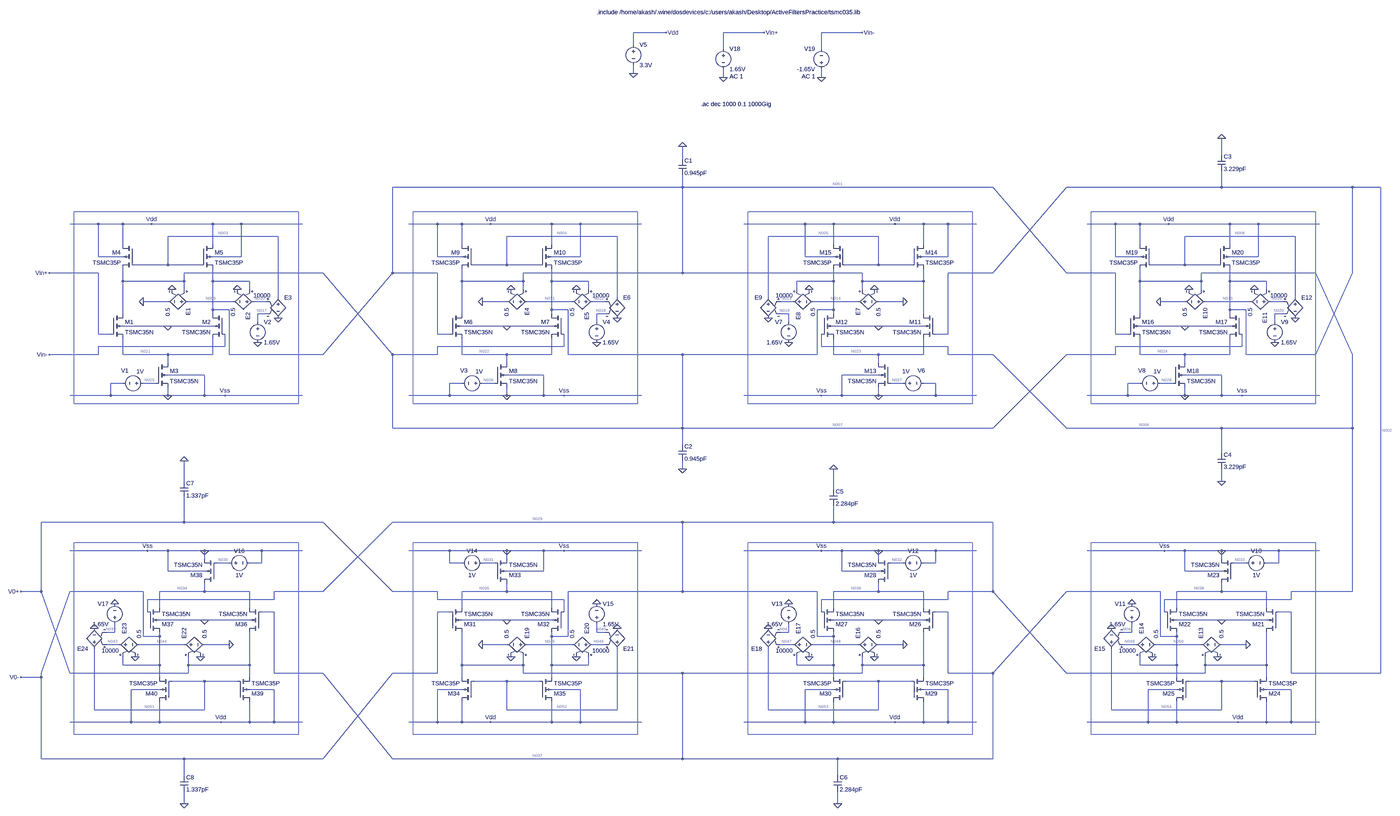
[diagram p0: schematic AFProject_Transistor_Level_Realization_2.asc, whole sheet]
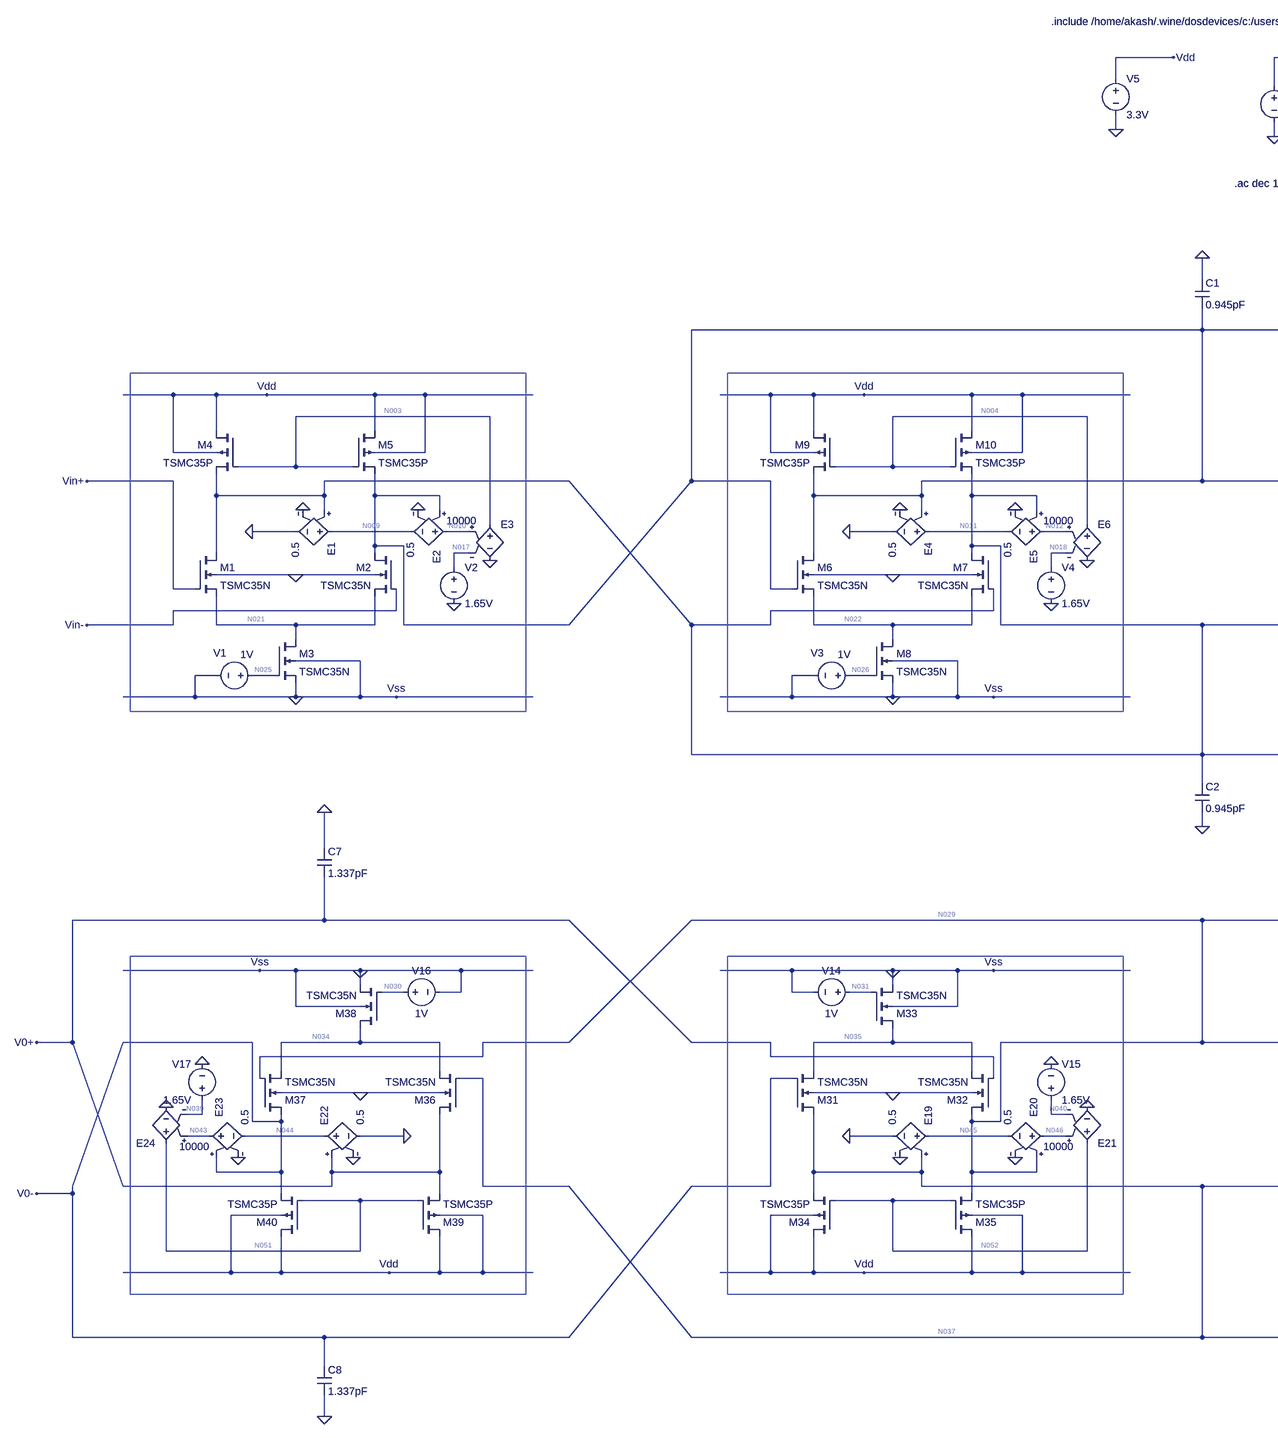
[diagram p1: schematic AFProject_Transistor_Level_Realization_2.asc, part, row 1 of 1, column 1 of 2]
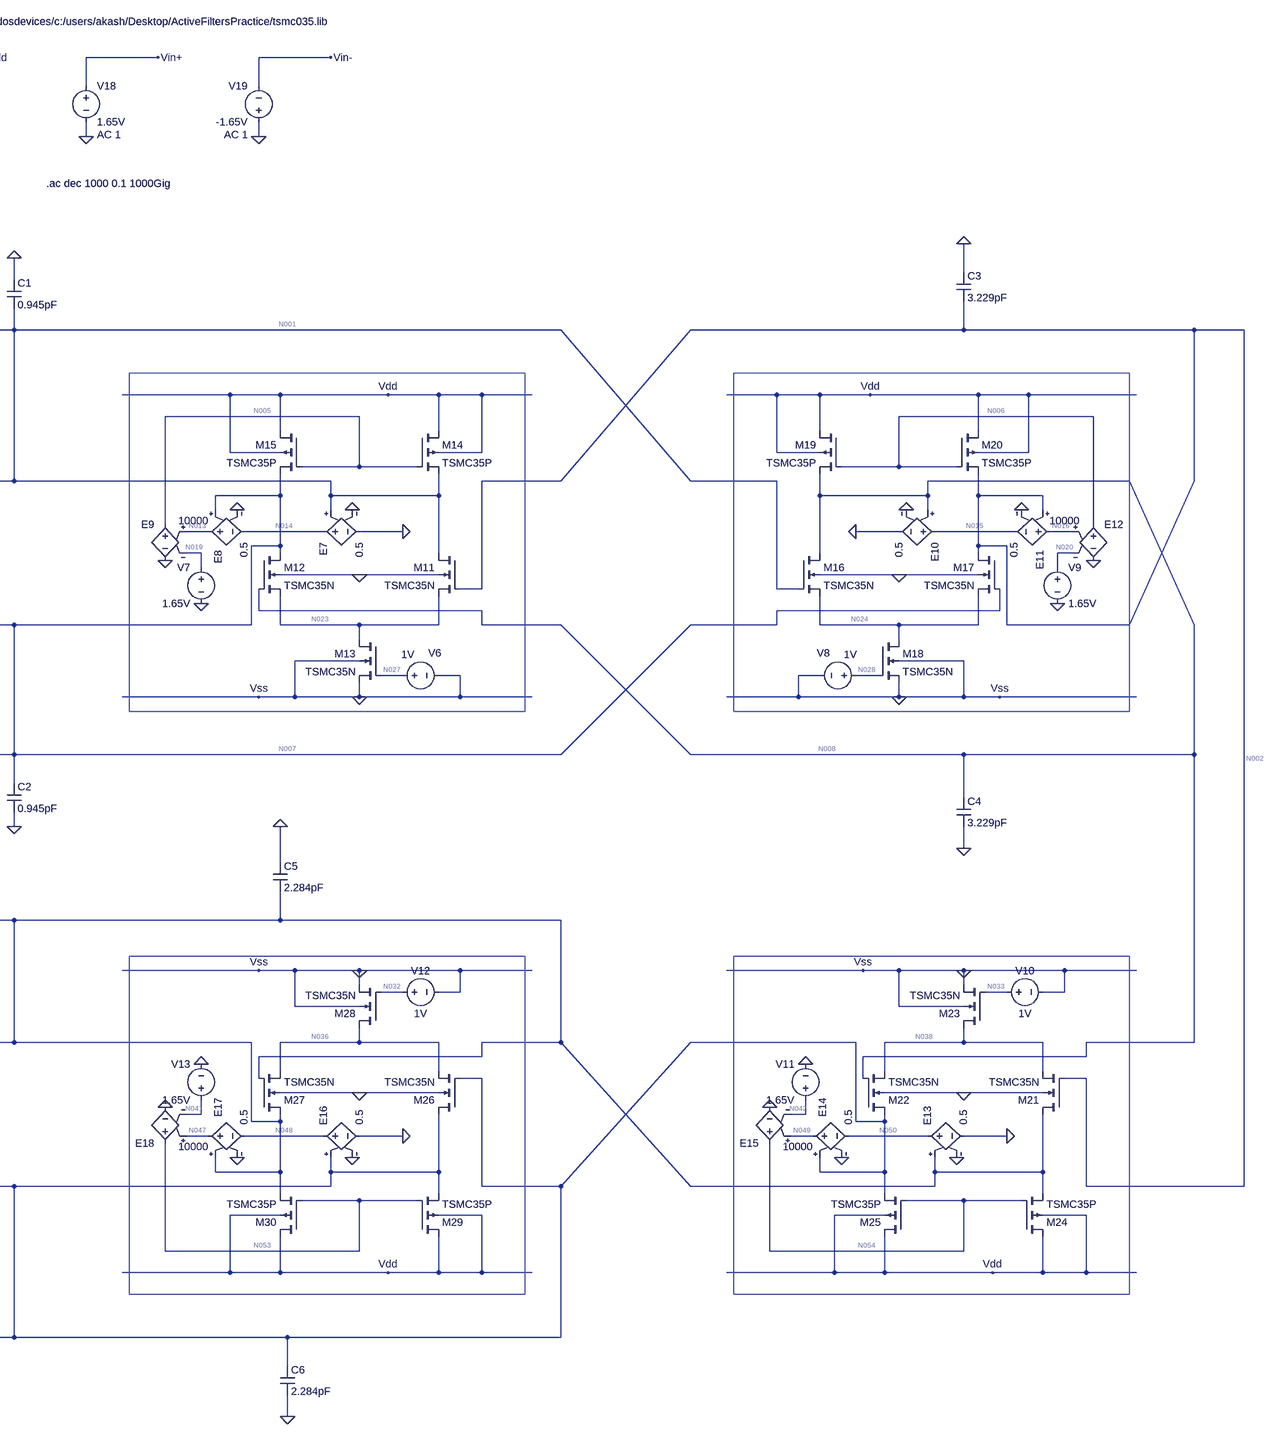
[diagram p2: schematic AFProject_Transistor_Level_Realization_2.asc, part, row 1 of 1, column 2 of 2]
AFProject_Transistor_Level_Realization_2.asc, the LTspice schematic file:
Version 4
SHEET 1 3012 3140
WIRE 192 96 64 96
WIRE 576 96 416 96
WIRE 960 96 800 96
WIRE 64 144 64 96
WIRE 416 160 416 96
WIRE 800 160 800 96
WIRE 64 256 64 224
WIRE 416 272 416 240
WIRE 800 272 800 240
WIRE 2368 576 2368 512
WIRE 256 592 256 544
WIRE 256 704 256 656
WIRE 256 704 -880 704
WIRE 1472 704 256 704
WIRE 2368 704 2368 640
WIRE 2368 704 1760 704
WIRE 2880 704 2368 704
WIRE 3008 704 2880 704
WIRE -2032 848 -2144 848
WIRE -1936 848 -2032 848
WIRE -1824 848 -1936 848
WIRE -1584 848 -1824 848
WIRE -1472 848 -1584 848
WIRE -1232 848 -1472 848
WIRE -704 848 -816 848
WIRE -608 848 -704 848
WIRE -496 848 -608 848
WIRE -256 848 -496 848
WIRE -144 848 -256 848
WIRE 96 848 -144 848
WIRE 736 848 496 848
WIRE 848 848 736 848
WIRE 1088 848 848 848
WIRE 1200 848 1088 848
WIRE 1296 848 1200 848
WIRE 1408 848 1296 848
WIRE 1952 848 1840 848
WIRE 2048 848 1952 848
WIRE 2160 848 2048 848
WIRE 2400 848 2160 848
WIRE 2512 848 2400 848
WIRE 2752 848 2512 848
WIRE -1328 896 -1760 896
WIRE 0 896 -432 896
WIRE 1024 896 592 896
WIRE 2656 896 2224 896
WIRE -1936 928 -1936 848
WIRE -1584 928 -1584 848
WIRE -608 928 -608 848
WIRE -256 928 -256 848
WIRE 848 928 848 848
WIRE 1200 928 1200 848
WIRE 2048 928 2048 848
WIRE 2400 928 2400 848
WIRE -2032 976 -2032 848
WIRE -1936 976 -2032 976
WIRE -1472 976 -1472 848
WIRE -1472 976 -1584 976
WIRE -704 976 -704 848
WIRE -608 976 -704 976
WIRE -144 976 -144 848
WIRE -144 976 -256 976
WIRE 736 976 736 848
WIRE 848 976 736 976
WIRE 1296 976 1296 848
WIRE 1296 976 1200 976
WIRE 1952 976 1952 848
WIRE 2048 976 1952 976
WIRE 2512 976 2512 848
WIRE 2512 976 2400 976
WIRE -1760 1008 -1760 896
WIRE -1760 1008 -1888 1008
WIRE -1632 1008 -1760 1008
WIRE -432 1008 -432 896
WIRE -432 1008 -560 1008
WIRE -304 1008 -432 1008
WIRE 1024 1008 1024 896
WIRE 1024 1008 896 1008
WIRE 1152 1008 1024 1008
WIRE 2224 1008 2224 896
WIRE 2224 1008 2096 1008
WIRE 2352 1008 2224 1008
WIRE -2032 1040 -2224 1040
WIRE -1152 1040 -1696 1040
WIRE -880 1040 -880 704
WIRE -704 1040 -880 1040
WIRE 256 1040 256 704
WIRE 256 1040 -368 1040
WIRE 960 1040 256 1040
WIRE 1472 1040 1760 704
WIRE 1472 1040 1296 1040
WIRE 1760 1040 1472 704
WIRE 1952 1040 1760 1040
WIRE 2736 1040 2288 1040
WIRE 2880 1040 2880 704
WIRE -1936 1072 -1936 1024
WIRE -1696 1072 -1696 1040
WIRE -1696 1072 -1936 1072
WIRE -1584 1072 -1584 1024
WIRE -1440 1072 -1584 1072
WIRE -608 1072 -608 1024
WIRE -368 1072 -368 1040
WIRE -368 1072 -608 1072
WIRE -256 1072 -256 1024
WIRE -112 1072 -256 1072
WIRE 848 1072 848 1024
WIRE 848 1072 704 1072
WIRE 960 1072 960 1040
WIRE 1200 1072 1200 1024
WIRE 1200 1072 960 1072
WIRE 2048 1072 2048 1024
WIRE 2288 1072 2288 1040
WIRE 2288 1072 2048 1072
WIRE 2400 1072 2400 1024
WIRE 2544 1072 2400 1072
WIRE -1696 1104 -1696 1072
WIRE -1440 1104 -1440 1072
WIRE -368 1104 -368 1072
WIRE -112 1104 -112 1072
WIRE 704 1104 704 1072
WIRE 960 1104 960 1072
WIRE 2288 1104 2288 1072
WIRE 2544 1104 2544 1072
WIRE -1328 1136 -1328 896
WIRE 0 1136 0 896
WIRE 592 1136 592 896
WIRE 2656 1136 2656 896
WIRE -1760 1152 -1856 1152
WIRE -1504 1152 -1680 1152
WIRE -1376 1152 -1424 1152
WIRE -432 1152 -528 1152
WIRE -176 1152 -352 1152
WIRE -48 1152 -96 1152
WIRE 688 1152 640 1152
WIRE 944 1152 768 1152
WIRE 1120 1152 1024 1152
WIRE 2224 1152 2128 1152
WIRE 2480 1152 2304 1152
WIRE 2608 1152 2560 1152
WIRE -1584 1184 -1584 1072
WIRE -1520 1184 -1584 1184
WIRE -256 1184 -256 1072
WIRE -192 1184 -256 1184
WIRE 848 1184 848 1072
WIRE 848 1184 784 1184
WIRE 2400 1184 2400 1072
WIRE 2464 1184 2400 1184
WIRE -1936 1200 -1936 1072
WIRE -1584 1200 -1584 1184
WIRE -1376 1200 -1408 1200
WIRE -608 1200 -608 1072
WIRE -256 1200 -256 1184
WIRE -48 1200 -80 1200
WIRE 672 1200 640 1200
WIRE 848 1200 848 1184
WIRE 1200 1200 1200 1072
WIRE 2048 1200 2048 1072
WIRE 2400 1200 2400 1184
WIRE 2608 1200 2576 1200
WIRE -1408 1232 -1408 1200
WIRE -80 1232 -80 1200
WIRE 672 1232 672 1200
WIRE 2576 1232 2576 1200
WIRE -1760 1248 -1936 1248
WIRE -1584 1248 -1760 1248
WIRE -432 1248 -608 1248
WIRE -256 1248 -432 1248
WIRE 1024 1248 848 1248
WIRE 1200 1248 1024 1248
WIRE 2224 1248 2048 1248
WIRE 2400 1248 2224 1248
WIRE -2032 1280 -2032 1040
WIRE -1984 1280 -2032 1280
WIRE -704 1280 -704 1040
WIRE -656 1280 -704 1280
WIRE 1296 1280 1296 1040
WIRE 1296 1280 1248 1280
WIRE 1952 1280 1952 1040
WIRE 2000 1280 1952 1280
WIRE -1536 1328 -1536 1280
WIRE -1536 1328 -2032 1328
WIRE -208 1328 -208 1280
WIRE -208 1328 -704 1328
WIRE 800 1328 800 1280
WIRE 1296 1328 800 1328
WIRE 2448 1328 2448 1280
WIRE 2448 1328 1952 1328
WIRE -2032 1360 -2032 1328
WIRE -2032 1360 -2224 1360
WIRE -1936 1360 -1936 1296
WIRE -1760 1360 -1936 1360
WIRE -1584 1360 -1584 1296
WIRE -1584 1360 -1760 1360
WIRE -1520 1360 -1520 1184
WIRE -1152 1360 -880 1040
WIRE -1152 1360 -1520 1360
WIRE -880 1360 -1152 1040
WIRE -704 1360 -704 1328
WIRE -704 1360 -880 1360
WIRE -608 1360 -608 1296
WIRE -432 1360 -608 1360
WIRE -256 1360 -256 1296
WIRE -256 1360 -432 1360
WIRE -192 1360 -192 1184
WIRE 256 1360 -192 1360
WIRE 784 1360 784 1184
WIRE 784 1360 256 1360
WIRE 848 1360 848 1296
WIRE 1024 1360 848 1360
WIRE 1200 1360 1200 1296
WIRE 1200 1360 1024 1360
WIRE 1296 1360 1296 1328
WIRE 1472 1360 1296 1360
WIRE 1952 1360 1952 1328
WIRE 1952 1360 1760 1360
WIRE 2048 1360 2048 1296
WIRE 2224 1360 2048 1360
WIRE 2400 1360 2400 1296
WIRE 2400 1360 2224 1360
WIRE 2464 1360 2464 1184
WIRE 2736 1360 2880 1040
WIRE 2736 1360 2464 1360
WIRE 2880 1360 2736 1040
WIRE -1760 1392 -1760 1360
WIRE -432 1392 -432 1360
WIRE 1024 1392 1024 1360
WIRE 2224 1392 2224 1360
WIRE -1616 1440 -1760 1440
WIRE -288 1440 -432 1440
WIRE 1024 1440 880 1440
WIRE 2368 1440 2224 1440
WIRE -1936 1472 -1984 1472
WIRE -1808 1472 -1856 1472
WIRE -608 1472 -656 1472
WIRE -480 1472 -528 1472
WIRE 1120 1472 1072 1472
WIRE 1248 1472 1200 1472
WIRE 2048 1472 2000 1472
WIRE 2176 1472 2128 1472
WIRE -1984 1520 -1984 1472
WIRE -1984 1520 -2144 1520
WIRE -1760 1520 -1760 1488
WIRE -1760 1520 -1984 1520
WIRE -1616 1520 -1616 1440
WIRE -1616 1520 -1760 1520
WIRE -1536 1520 -1616 1520
WIRE -1232 1520 -1536 1520
WIRE -656 1520 -656 1472
WIRE -656 1520 -816 1520
WIRE -432 1520 -432 1488
WIRE -432 1520 -656 1520
WIRE -288 1520 -288 1440
WIRE -288 1520 -432 1520
WIRE -208 1520 -288 1520
WIRE 96 1520 -208 1520
WIRE 800 1520 496 1520
WIRE 880 1520 880 1440
WIRE 880 1520 800 1520
WIRE 1024 1520 1024 1488
WIRE 1024 1520 880 1520
WIRE 1248 1520 1248 1472
WIRE 1248 1520 1024 1520
WIRE 1408 1520 1248 1520
WIRE 2000 1520 2000 1472
WIRE 2000 1520 1840 1520
WIRE 2224 1520 2224 1488
WIRE 2224 1520 2000 1520
WIRE 2368 1520 2368 1440
WIRE 2368 1520 2224 1520
WIRE 2448 1520 2368 1520
WIRE 2752 1520 2448 1520
WIRE -880 1648 -880 1360
WIRE 256 1648 256 1360
WIRE 256 1648 -880 1648
WIRE 1472 1648 1760 1360
WIRE 1472 1648 256 1648
WIRE 1760 1648 1472 1360
WIRE 2368 1648 1760 1648
WIRE 2880 1648 2880 1360
WIRE 2880 1648 2368 1648
WIRE 256 1712 256 1648
WIRE 2368 1744 2368 1648
WIRE 256 1808 256 1776
WIRE -1696 1856 -1696 1776
WIRE 2368 1856 2368 1808
WIRE 848 1888 848 1808
WIRE -1696 2016 -1696 1920
WIRE -1696 2016 -2256 2016
WIRE -1152 2016 -1696 2016
WIRE 256 2016 -880 2016
WIRE 848 2016 848 1952
WIRE 848 2016 256 2016
WIRE 1472 2016 848 2016
WIRE -1840 2128 -2144 2128
WIRE -1760 2128 -1840 2128
WIRE -1616 2128 -1760 2128
WIRE -1392 2128 -1616 2128
WIRE -1232 2128 -1392 2128
WIRE -656 2128 -816 2128
WIRE -432 2128 -656 2128
WIRE -288 2128 -432 2128
WIRE -208 2128 -288 2128
WIRE 96 2128 -208 2128
WIRE 800 2128 496 2128
WIRE 880 2128 800 2128
WIRE 1024 2128 880 2128
WIRE 1248 2128 1024 2128
WIRE 1408 2128 1248 2128
WIRE 2144 2128 1840 2128
WIRE 2224 2128 2144 2128
WIRE 2368 2128 2224 2128
WIRE 2592 2128 2368 2128
WIRE 2752 2128 2592 2128
WIRE -1616 2160 -1616 2128
WIRE -432 2160 -432 2128
WIRE 1024 2160 1024 2128
WIRE 2368 2160 2368 2128
WIRE -1520 2176 -1568 2176
WIRE -1392 2176 -1392 2128
WIRE -1392 2176 -1440 2176
WIRE -656 2176 -656 2128
WIRE -608 2176 -656 2176
WIRE -480 2176 -528 2176
WIRE 1120 2176 1072 2176
WIRE 1248 2176 1248 2128
WIRE 1248 2176 1200 2176
WIRE 2464 2176 2416 2176
WIRE 2592 2176 2592 2128
WIRE 2592 2176 2544 2176
WIRE -1760 2208 -1760 2128
WIRE -1616 2208 -1760 2208
WIRE -288 2208 -288 2128
WIRE -288 2208 -432 2208
WIRE 880 2208 880 2128
WIRE 1024 2208 880 2208
WIRE 2224 2208 2224 2128
WIRE 2368 2208 2224 2208
WIRE -2256 2288 -2256 2016
WIRE -2256 2288 -2336 2288
WIRE -1856 2288 -2144 2288
WIRE -1616 2288 -1616 2256
WIRE -1616 2288 -1792 2288
WIRE -1440 2288 -1616 2288
WIRE -1152 2288 -880 2016
WIRE -1152 2288 -1344 2288
WIRE -880 2288 -1152 2016
WIRE -704 2288 -880 2288
WIRE -432 2288 -432 2256
WIRE -432 2288 -608 2288
WIRE -256 2288 -432 2288
WIRE 256 2288 256 2016
WIRE 256 2288 -192 2288
WIRE 784 2288 256 2288
WIRE 1024 2288 1024 2256
WIRE 1024 2288 848 2288
WIRE 1200 2288 1024 2288
WIRE 1472 2288 1472 2016
WIRE 1472 2288 1296 2288
WIRE 2128 2288 1760 2288
WIRE 2368 2288 2368 2256
WIRE 2368 2288 2192 2288
WIRE 2544 2288 2368 2288
WIRE 2880 2288 2880 1648
WIRE 2880 2288 2640 2288
WIRE -1344 2320 -1344 2288
WIRE -1344 2320 -1840 2320
WIRE -704 2320 -704 2288
WIRE -208 2320 -704 2320
WIRE 1296 2320 1296 2288
WIRE 1296 2320 800 2320
WIRE 2640 2320 2640 2288
WIRE 2640 2320 2144 2320
WIRE -1792 2352 -1792 2288
WIRE -1440 2352 -1440 2288
WIRE -608 2352 -608 2288
WIRE -256 2352 -256 2288
WIRE 848 2352 848 2288
WIRE 1200 2352 1200 2288
WIRE 2192 2352 2192 2288
WIRE 2544 2352 2544 2288
WIRE -1840 2368 -1840 2320
WIRE -1344 2368 -1392 2368
WIRE -656 2368 -704 2368
WIRE -208 2368 -208 2320
WIRE 800 2368 800 2320
WIRE 1296 2368 1248 2368
WIRE 2144 2368 2144 2320
WIRE 2640 2368 2592 2368
WIRE -1616 2400 -1792 2400
WIRE -1440 2400 -1616 2400
WIRE -432 2400 -608 2400
WIRE -256 2400 -432 2400
WIRE 1024 2400 848 2400
WIRE 1200 2400 1024 2400
WIRE 2368 2400 2192 2400
WIRE 2544 2400 2368 2400
WIRE -1968 2448 -1968 2416
WIRE -1968 2448 -2000 2448
WIRE -80 2448 -80 2416
WIRE -48 2448 -80 2448
WIRE 672 2448 672 2416
WIRE 672 2448 640 2448
WIRE 2016 2448 2016 2416
WIRE 2016 2448 1984 2448
WIRE -1856 2464 -1856 2288
WIRE -1792 2464 -1792 2448
WIRE -1792 2464 -1856 2464
WIRE -256 2464 -256 2448
WIRE -192 2464 -192 2288
WIRE -192 2464 -256 2464
WIRE 784 2464 784 2288
WIRE 848 2464 848 2448
WIRE 848 2464 784 2464
WIRE 2128 2464 2128 2288
WIRE 2192 2464 2192 2448
WIRE 2192 2464 2128 2464
WIRE -1952 2496 -2000 2496
WIRE -1696 2496 -1872 2496
WIRE -1520 2496 -1616 2496
WIRE -432 2496 -528 2496
WIRE -176 2496 -352 2496
WIRE -48 2496 -96 2496
WIRE 688 2496 640 2496
WIRE 944 2496 768 2496
WIRE 1120 2496 1024 2496
WIRE 2032 2496 1984 2496
WIRE 2288 2496 2112 2496
WIRE 2464 2496 2368 2496
WIRE -1936 2576 -1936 2544
WIRE -1792 2576 -1792 2464
WIRE -1792 2576 -1936 2576
WIRE -1680 2576 -1680 2544
WIRE -1440 2576 -1440 2448
WIRE -1440 2576 -1680 2576
WIRE -608 2576 -608 2448
WIRE -368 2576 -368 2544
WIRE -368 2576 -608 2576
WIRE -256 2576 -256 2464
WIRE -112 2576 -112 2544
WIRE -112 2576 -256 2576
WIRE 704 2576 704 2544
WIRE 848 2576 848 2464
WIRE 848 2576 704 2576
WIRE 960 2576 960 2544
WIRE 1200 2576 1200 2448
WIRE 1200 2576 960 2576
WIRE 2048 2576 2048 2544
WIRE 2192 2576 2192 2464
WIRE 2192 2576 2048 2576
WIRE 2304 2576 2304 2544
WIRE 2544 2576 2544 2448
WIRE 2544 2576 2304 2576
WIRE -2256 2608 -2144 2288
WIRE -2144 2608 -2256 2288
WIRE -1680 2608 -1680 2576
WIRE -1680 2608 -2144 2608
WIRE -1344 2608 -1344 2368
WIRE -1152 2608 -1344 2608
WIRE -704 2608 -704 2368
WIRE -704 2608 -880 2608
WIRE -368 2608 -368 2576
WIRE 256 2608 -368 2608
WIRE 960 2608 960 2576
WIRE 960 2608 256 2608
WIRE 1296 2608 1296 2368
WIRE 1472 2608 1760 2288
WIRE 1472 2608 1296 2608
WIRE 1760 2608 1472 2288
WIRE 2304 2608 2304 2576
WIRE 2304 2608 1760 2608
WIRE 2640 2608 2640 2368
WIRE 3008 2608 3008 704
WIRE 3008 2608 2640 2608
WIRE -2256 2624 -2256 2608
WIRE -2256 2624 -2336 2624
WIRE -1792 2624 -1792 2576
WIRE -1440 2624 -1440 2576
WIRE -608 2624 -608 2576
WIRE -256 2624 -256 2576
WIRE 848 2624 848 2576
WIRE 1200 2624 1200 2576
WIRE 2192 2624 2192 2576
WIRE 2544 2624 2544 2576
WIRE -1616 2640 -1744 2640
WIRE -1488 2640 -1616 2640
WIRE -432 2640 -560 2640
WIRE -304 2640 -432 2640
WIRE 1024 2640 896 2640
WIRE 1152 2640 1024 2640
WIRE 2368 2640 2240 2640
WIRE 2496 2640 2368 2640
WIRE -1792 2672 -1904 2672
WIRE -1344 2672 -1440 2672
WIRE -608 2672 -704 2672
WIRE -144 2672 -256 2672
WIRE 848 2672 736 2672
WIRE 1296 2672 1200 2672
WIRE 2192 2672 2080 2672
WIRE 2640 2672 2544 2672
WIRE -2048 2752 -2048 2512
WIRE -1616 2752 -1616 2640
WIRE -1616 2752 -2048 2752
WIRE -432 2752 -432 2640
WIRE 0 2752 0 2512
WIRE 0 2752 -432 2752
WIRE 592 2752 592 2512
WIRE 1024 2752 1024 2640
WIRE 1024 2752 592 2752
WIRE 1936 2752 1936 2512
WIRE 2368 2752 2368 2640
WIRE 2368 2752 1936 2752
WIRE -1904 2800 -1904 2672
WIRE -1904 2800 -2144 2800
WIRE -1792 2800 -1792 2720
WIRE -1792 2800 -1904 2800
WIRE -1552 2800 -1792 2800
WIRE -1440 2800 -1440 2720
WIRE -1440 2800 -1552 2800
WIRE -1344 2800 -1344 2672
WIRE -1344 2800 -1440 2800
WIRE -1232 2800 -1344 2800
WIRE -704 2800 -704 2672
WIRE -704 2800 -816 2800
WIRE -608 2800 -608 2720
WIRE -608 2800 -704 2800
WIRE -496 2800 -608 2800
WIRE -256 2800 -256 2720
WIRE -256 2800 -496 2800
WIRE -144 2800 -144 2672
WIRE -144 2800 -256 2800
WIRE 96 2800 -144 2800
WIRE 736 2800 736 2672
WIRE 736 2800 496 2800
WIRE 848 2800 848 2720
WIRE 848 2800 736 2800
WIRE 1088 2800 848 2800
WIRE 1200 2800 1200 2720
WIRE 1200 2800 1088 2800
WIRE 1296 2800 1296 2672
WIRE 1296 2800 1200 2800
WIRE 1408 2800 1296 2800
WIRE 2080 2800 2080 2672
WIRE 2080 2800 1840 2800
WIRE 2192 2800 2192 2720
WIRE 2192 2800 2080 2800
WIRE 2432 2800 2192 2800
WIRE 2544 2800 2544 2720
WIRE 2544 2800 2432 2800
WIRE 2640 2800 2640 2672
WIRE 2640 2800 2544 2800
WIRE 2752 2800 2640 2800
WIRE -2256 2944 -2256 2624
WIRE -1696 2944 -2256 2944
WIRE -1152 2944 -880 2608
WIRE -1152 2944 -1696 2944
WIRE -880 2944 -1152 2608
WIRE 256 2944 256 2608
WIRE 256 2944 -880 2944
WIRE 864 2944 256 2944
WIRE 1472 2944 1472 2608
WIRE 1472 2944 864 2944
WIRE -1696 3008 -1696 2944
WIRE 864 3008 864 2944
WIRE -1696 3120 -1696 3072
WIRE 864 3120 864 3072
FLAG -1760 1248 0
FLAG -1856 1152 0
FLAG -1328 1216 0
FLAG -1760 1520 0
FLAG -1744 1104 0
FLAG -1488 1104 0
FLAG -1408 1312 0
FLAG -1824 848 Vdd
FLAG -1536 1520 Vss
FLAG 64 256 0
FLAG 192 96 Vdd
FLAG -432 1248 0
FLAG -528 1152 0
FLAG 0 1216 0
FLAG -432 1520 0
FLAG -416 1104 0
FLAG -160 1104 0
FLAG -80 1312 0
FLAG -496 848 Vdd
FLAG -208 1520 Vss
FLAG 1024 1248 0
FLAG 1120 1152 0
FLAG 592 1216 0
FLAG 1024 1520 0
FLAG 1008 1104 0
FLAG 752 1104 0
FLAG 672 1312 0
FLAG 1088 848 Vdd
FLAG 800 1520 Vss
FLAG 2224 1248 0
FLAG 2128 1152 0
FLAG 2656 1216 0
FLAG 2224 1520 0
FLAG 2240 1104 0
FLAG 2496 1104 0
FLAG 2576 1312 0
FLAG 2160 848 Vdd
FLAG 2448 1520 Vss
FLAG 2368 2400 0
FLAG 2464 2496 0
FLAG 1936 2432 0
FLAG 2368 2128 0
FLAG 2352 2544 0
FLAG 2096 2544 0
FLAG 2016 2336 0
FLAG 2432 2800 Vdd
FLAG 2144 2128 Vss
FLAG 1024 2400 0
FLAG 1120 2496 0
FLAG 592 2432 0
FLAG 1024 2128 0
FLAG 1008 2544 0
FLAG 752 2544 0
FLAG 672 2336 0
FLAG 1088 2800 Vdd
FLAG 800 2128 Vss
FLAG -432 2400 0
FLAG -528 2496 0
FLAG 0 2432 0
FLAG -432 2128 0
FLAG -416 2544 0
FLAG -160 2544 0
FLAG -80 2336 0
FLAG -496 2800 Vdd
FLAG -208 2128 Vss
FLAG -1616 2400 0
FLAG -1520 2496 0
FLAG -2048 2432 0
FLAG -1616 2128 0
FLAG -1632 2544 0
FLAG -1888 2544 0
FLAG -1968 2336 0
FLAG -1552 2800 Vdd
FLAG -1840 2128 Vss
FLAG -2224 1040 Vin+
FLAG -2224 1360 Vin-
FLAG 256 544 0
FLAG 256 1808 0
FLAG 2368 512 0
FLAG 2368 1856 0
FLAG 848 1808 0
FLAG 864 3120 0
FLAG -2336 2288 V0+
FLAG -2336 2624 V0-
FLAG -1696 1776 0
FLAG -1696 3120 0
FLAG 416 272 0
FLAG 576 96 Vin+
FLAG 800 272 0
FLAG 960 96 Vin-
SYMBOL nmos4 -1984 1200 R0
SYMATTR InstName M1
SYMATTR Value TSMC35N
SYMATTR Value2 l=0.5u w=1.77u m=8
SYMBOL nmos4 -1536 1200 M0
SYMATTR InstName M2
SYMATTR Value TSMC35N
SYMATTR Value2 l=0.5u w=1.77u m=8
SYMBOL nmos4 -1808 1392 R0
SYMATTR InstName M3
SYMATTR Value TSMC35N
SYMATTR Value2 l=0.5u w=1.33u m=16
SYMBOL pmos4 -1888 928 M0
SYMATTR InstName M4
SYMATTR Value TSMC35P
SYMATTR Value2 l=0.5u w=1u m=8
SYMBOL pmos4 -1632 928 R0
SYMATTR InstName M5
SYMATTR Value TSMC35P
SYMATTR Value2 l=0.5u w=1u m=8
SYMBOL voltage -1840 1472 R90
WINDOW 0 -34 88 VBottom 2
WINDOW 3 -62 28 VTop 2
SYMATTR InstName V1
SYMATTR Value 1V
SYMBOL e -1664 1152 R90
SYMATTR InstName E1
SYMATTR Value 0.5
SYMBOL e -1408 1152 R90
WINDOW 0 42 38 Left 2
SYMATTR InstName E2
SYMATTR Value 0.5
SYMBOL e -1328 1120 R0
WINDOW 3 -97 8 Left 2
SYMATTR InstName E3
SYMATTR Value 10000
SYMBOL voltage -1408 1216 R0
SYMATTR InstName V2
SYMATTR Value 1.65V
SYMBOL voltage 64 128 R0
SYMATTR InstName V5
SYMATTR Value 3.3V
SYMBOL nmos4 -656 1200 R0
SYMATTR InstName M6
SYMATTR Value TSMC35N
SYMATTR Value2 l=0.5u w=1.77u m=8
SYMBOL nmos4 -208 1200 M0
SYMATTR InstName M7
SYMATTR Value TSMC35N
SYMATTR Value2 l=0.5u w=1.77u m=8
SYMBOL nmos4 -480 1392 R0
SYMATTR InstName M8
SYMATTR Value TSMC35N
SYMATTR Value2 l=0.5u w=1.33u m=16
SYMBOL pmos4 -560 928 M0
SYMATTR InstName M9
SYMATTR Value TSMC35P
SYMATTR Value2 l=0.5u w=1u m=8
SYMBOL pmos4 -304 928 R0
SYMATTR InstName M10
SYMATTR Value TSMC35P
SYMATTR Value2 l=0.5u w=1u m=8
SYMBOL voltage -512 1472 R90
WINDOW 0 -34 88 VBottom 2
WINDOW 3 -62 28 VTop 2
SYMATTR InstName V3
SYMATTR Value 1V
SYMBOL e -336 1152 R90
SYMATTR InstName E4
SYMATTR Value 0.5
SYMBOL e -80 1152 R90
WINDOW 0 42 38 Left 2
SYMATTR InstName E5
SYMATTR Value 0.5
SYMBOL e 0 1120 R0
WINDOW 3 -97 8 Left 2
SYMATTR InstName E6
SYMATTR Value 10000
SYMBOL voltage -80 1216 R0
SYMATTR InstName V4
SYMATTR Value 1.65V
SYMBOL nmos4 1248 1200 M0
SYMATTR InstName M11
SYMATTR Value TSMC35N
SYMATTR Value2 l=0.5u w=1.77u m=8
SYMBOL nmos4 800 1200 R0
SYMATTR InstName M12
SYMATTR Value TSMC35N
SYMATTR Value2 l=0.5u w=1.77u m=8
SYMBOL nmos4 1072 1392 M0
SYMATTR InstName M13
SYMATTR Value TSMC35N
SYMATTR Value2 l=0.5u w=1.33u m=16
SYMBOL pmos4 1152 928 R0
SYMATTR InstName M14
SYMATTR Value TSMC35P
SYMATTR Value2 l=0.5u w=1u m=8
SYMBOL pmos4 896 928 M0
SYMATTR InstName M15
SYMATTR Value TSMC35P
SYMATTR Value2 l=0.5u w=1u m=8
SYMBOL voltage 1104 1472 M90
WINDOW 0 -34 88 VBottom 2
WINDOW 3 -62 28 VTop 2
SYMATTR InstName V6
SYMATTR Value 1V
SYMBOL e 928 1152 M90
SYMATTR InstName E7
SYMATTR Value 0.5
SYMBOL e 672 1152 M90
WINDOW 0 42 38 Left 2
SYMATTR InstName E8
SYMATTR Value 0.5
SYMBOL e 592 1120 M0
WINDOW 3 -97 8 Left 2
SYMATTR InstName E9
SYMATTR Value 10000
SYMBOL voltage 672 1216 M0
SYMATTR InstName V7
SYMATTR Value 1.65V
SYMBOL nmos4 2000 1200 R0
SYMATTR InstName M16
SYMATTR Value TSMC35N
SYMATTR Value2 l=0.5u w=1.77u m=8
SYMBOL nmos4 2448 1200 M0
SYMATTR InstName M17
SYMATTR Value TSMC35N
SYMATTR Value2 l=0.5u w=1.77u m=8
SYMBOL nmos4 2176 1392 R0
SYMATTR InstName M18
SYMATTR Value TSMC35N
SYMATTR Value2 l=0.5u w=1.33u m=16
SYMBOL pmos4 2096 928 M0
SYMATTR InstName M19
SYMATTR Value TSMC35P
SYMATTR Value2 l=0.5u w=1u m=8
SYMBOL pmos4 2352 928 R0
SYMATTR InstName M20
SYMATTR Value TSMC35P
SYMATTR Value2 l=0.5u w=1u m=8
SYMBOL voltage 2144 1472 R90
WINDOW 0 -34 88 VBottom 2
WINDOW 3 -62 28 VTop 2
SYMATTR InstName V8
SYMATTR Value 1V
SYMBOL e 2320 1152 R90
SYMATTR InstName E10
SYMATTR Value 0.5
SYMBOL e 2576 1152 R90
WINDOW 0 42 38 Left 2
SYMATTR InstName E11
SYMATTR Value 0.5
SYMBOL e 2656 1120 R0
WINDOW 3 -97 8 Left 2
SYMATTR InstName E12
SYMATTR Value 10000
SYMBOL voltage 2576 1216 R0
SYMATTR InstName V9
SYMATTR Value 1.65V
SYMBOL nmos4 2592 2448 R180
SYMATTR InstName M21
SYMATTR Value TSMC35N
SYMATTR Value2 l=0.5u w=1.77u m=8
SYMBOL nmos4 2144 2448 M180
SYMATTR InstName M22
SYMATTR Value TSMC35N
SYMATTR Value2 l=0.5u w=1.77u m=8
SYMBOL nmos4 2416 2256 R180
SYMATTR InstName M23
SYMATTR Value TSMC35N
SYMATTR Value2 l=0.5u w=1.33u m=16
SYMBOL pmos4 2496 2720 M180
SYMATTR InstName M24
SYMATTR Value TSMC35P
SYMATTR Value2 l=0.5u w=1u m=8
SYMBOL pmos4 2240 2720 R180
SYMATTR InstName M25
SYMATTR Value TSMC35P
SYMATTR Value2 l=0.5u w=1u m=8
SYMBOL voltage 2448 2176 R270
WINDOW 0 32 56 VTop 2
WINDOW 3 -32 56 VBottom 2
SYMATTR InstName V10
SYMATTR Value 1V
SYMBOL e 2272 2496 R270
SYMATTR InstName E13
SYMATTR Value 0.5
SYMBOL e 2016 2496 R270
WINDOW 0 42 38 Left 2
SYMATTR InstName E14
SYMATTR Value 0.5
SYMBOL e 1936 2528 R180
WINDOW 3 -97 8 Left 2
SYMATTR InstName E15
SYMATTR Value 10000
SYMBOL voltage 2016 2432 R180
WINDOW 0 24 96 Left 2
WINDOW 3 24 16 Left 2
SYMATTR InstName V11
SYMATTR Value 1.65V
SYMBOL nmos4 1248 2448 R180
SYMATTR InstName M26
SYMATTR Value TSMC35N
SYMATTR Value2 l=0.5u w=1.77u m=8
SYMBOL nmos4 800 2448 M180
SYMATTR InstName M27
SYMATTR Value TSMC35N
SYMATTR Value2 l=0.5u w=1.77u m=8
SYMBOL nmos4 1072 2256 R180
SYMATTR InstName M28
SYMATTR Value TSMC35N
SYMATTR Value2 l=0.5u w=1.33u m=16
SYMBOL pmos4 1152 2720 M180
SYMATTR InstName M29
SYMATTR Value TSMC35P
SYMATTR Value2 l=0.5u w=1u m=8
SYMBOL pmos4 896 2720 R180
SYMATTR InstName M30
SYMATTR Value TSMC35P
SYMATTR Value2 l=0.5u w=1u m=8
SYMBOL voltage 1104 2176 R270
WINDOW 0 32 56 VTop 2
WINDOW 3 -32 56 VBottom 2
SYMATTR InstName V12
SYMATTR Value 1V
SYMBOL e 928 2496 R270
SYMATTR InstName E16
SYMATTR Value 0.5
SYMBOL e 672 2496 R270
WINDOW 0 42 38 Left 2
SYMATTR InstName E17
SYMATTR Value 0.5
SYMBOL e 592 2528 R180
WINDOW 3 -97 8 Left 2
SYMATTR InstName E18
SYMATTR Value 10000
SYMBOL voltage 672 2432 R180
WINDOW 0 24 96 Left 2
WINDOW 3 24 16 Left 2
SYMATTR InstName V13
SYMATTR Value 1.65V
SYMBOL nmos4 -656 2448 M180
SYMATTR InstName M31
SYMATTR Value TSMC35N
SYMATTR Value2 l=0.5u w=1.77u m=8
SYMBOL nmos4 -208 2448 R180
SYMATTR InstName M32
SYMATTR Value TSMC35N
SYMATTR Value2 l=0.5u w=1.77u m=8
SYMBOL nmos4 -480 2256 M180
SYMATTR InstName M33
SYMATTR Value TSMC35N
SYMATTR Value2 l=0.5u w=1.33u m=16
SYMBOL pmos4 -560 2720 R180
SYMATTR InstName M34
SYMATTR Value TSMC35P
SYMATTR Value2 l=0.5u w=1u m=8
SYMBOL pmos4 -304 2720 M180
SYMATTR InstName M35
SYMATTR Value TSMC35P
SYMATTR Value2 l=0.5u w=1u m=8
SYMBOL voltage -512 2176 M270
WINDOW 0 32 56 VTop 2
WINDOW 3 -32 56 VBottom 2
SYMATTR InstName V14
SYMATTR Value 1V
SYMBOL e -336 2496 M270
SYMATTR InstName E19
SYMATTR Value 0.5
SYMBOL e -80 2496 M270
WINDOW 0 42 38 Left 2
SYMATTR InstName E20
SYMATTR Value 0.5
SYMBOL e 0 2528 M180
WINDOW 3 -97 8 Left 2
SYMATTR InstName E21
SYMATTR Value 10000
SYMBOL voltage -80 2432 M180
WINDOW 0 24 96 Left 2
WINDOW 3 24 16 Left 2
SYMATTR InstName V15
SYMATTR Value 1.65V
SYMBOL nmos4 -1392 2448 R180
SYMATTR InstName M36
SYMATTR Value TSMC35N
SYMATTR Value2 l=0.5u w=1.77u m=8
SYMBOL nmos4 -1840 2448 M180
SYMATTR InstName M37
SYMATTR Value TSMC35N
SYMATTR Value2 l=0.5u w=1.77u m=8
SYMBOL nmos4 -1568 2256 R180
SYMATTR InstName M38
SYMATTR Value TSMC35N
SYMATTR Value2 l=0.5u w=1.33u m=16
SYMBOL pmos4 -1488 2720 M180
SYMATTR InstName M39
SYMATTR Value TSMC35P
SYMATTR Value2 l=0.5u w=1u m=8
SYMBOL pmos4 -1744 2720 R180
SYMATTR InstName M40
SYMATTR Value TSMC35P
SYMATTR Value2 l=0.5u w=1u m=8
SYMBOL voltage -1536 2176 R270
WINDOW 0 32 56 VTop 2
WINDOW 3 -32 56 VBottom 2
SYMATTR InstName V16
SYMATTR Value 1V
SYMBOL e -1712 2496 R270
SYMATTR InstName E22
SYMATTR Value 0.5
SYMBOL e -1968 2496 R270
WINDOW 0 42 38 Left 2
SYMATTR InstName E23
SYMATTR Value 0.5
SYMBOL e -2048 2528 R180
WINDOW 3 -97 8 Left 2
SYMATTR InstName E24
SYMATTR Value 10000
SYMBOL voltage -1968 2432 R180
WINDOW 0 24 96 Left 2
WINDOW 3 24 16 Left 2
SYMATTR InstName V17
SYMATTR Value 1.65V
SYMBOL cap 240 592 R0
SYMATTR InstName C1
SYMATTR Value 0.945pF
SYMBOL cap 240 1712 R0
SYMATTR InstName C2
SYMATTR Value 0.945pF
SYMBOL cap 2352 576 R0
SYMATTR InstName C3
SYMATTR Value 3.229pF
SYMBOL cap 2352 1744 R0
SYMATTR InstName C4
SYMATTR Value 3.229pF
SYMBOL cap 832 1888 R0
SYMATTR InstName C5
SYMATTR Value 2.284pF
SYMBOL cap 848 3008 R0
SYMATTR InstName C6
SYMATTR Value 2.284pF
SYMBOL cap -1712 1856 R0
SYMATTR InstName C7
SYMATTR Value 1.337pF
SYMBOL cap -1712 3008 R0
SYMATTR InstName C8
SYMATTR Value 1.337pF
SYMBOL voltage 416 144 R0
WINDOW 123 24 124 Left 2
WINDOW 39 0 0 Left 0
SYMATTR InstName V18
SYMATTR Value 1.65V
SYMATTR Value2 AC 1
SYMBOL voltage 800 256 R180
WINDOW 0 24 96 Left 2
WINDOW 3 24 16 Left 2
WINDOW 123 24 -12 Left 2
WINDOW 39 0 0 Left 0
SYMATTR InstName V19
SYMATTR Value -1.65V
SYMATTR Value2 AC 1
TEXT -80 16 Left 2 !.include /home/akash/.wine/dosdevices/c:/users/akash/Desktop/ActiveFiltersPractice/tsmc035.lib
TEXT 328 376 Left 2 !.ac dec 1000 0.1 1000Gig
LINE Normal -2128 1552 -2128 800
LINE Normal -1248 1552 -2128 1552
LINE Normal -1248 800 -1248 1552
LINE Normal -2128 800 -1248 800
LINE Normal -800 1552 -800 800
LINE Normal 80 1552 -800 1552
LINE Normal 80 800 80 1552
LINE Normal -800 800 80 800
LINE Normal 1392 1552 1392 800
LINE Normal 512 1552 1392 1552
LINE Normal 512 800 512 1552
LINE Normal 1392 800 512 800
LINE Normal 1856 1552 1856 800
LINE Normal 2736 1552 1856 1552
LINE Normal 2736 800 2736 1552
LINE Normal 1856 800 2736 800
LINE Normal 2736 2096 2736 2848
LINE Normal 1856 2096 2736 2096
LINE Normal 1856 2848 1856 2096
LINE Normal 2736 2848 1856 2848
LINE Normal 1392 2096 1392 2848
LINE Normal 512 2096 1392 2096
LINE Normal 512 2848 512 2096
LINE Normal 1392 2848 512 2848
LINE Normal -800 2096 -800 2848
LINE Normal 80 2096 -800 2096
LINE Normal 80 2848 80 2096
LINE Normal -800 2848 80 2848
LINE Normal -1248 2096 -1248 2848
LINE Normal -2128 2096 -1248 2096
LINE Normal -2128 2848 -2128 2096
LINE Normal -1248 2848 -2128 2848

The netlist it stands for:
* AFProject_Transistor_Level_Realization_2.asc
M1 N007 Vin+ N021 0 TSMC35N l=0.5u w=1.77u m=8
M2 N001 Vin- N021 0 TSMC35N l=0.5u w=1.77u m=8
M3 N021 N025 0 0 TSMC35N l=0.5u w=1.33u m=16
M4 Vdd N003 N007 Vdd TSMC35P l=0.5u w=1u m=8
M5 Vdd N003 N001 Vdd TSMC35P l=0.5u w=1u m=8
V1 N025 0 1V
E1 N009 0 N007 0 0.5
E2 N010 N009 N001 0 0.5
E3 N003 0 N010 N017 10000
V2 N017 0 1.65V
V5 Vdd 0 3.3V
M6 N001 N001 N022 0 TSMC35N l=0.5u w=1.77u m=8
M7 N007 N007 N022 0 TSMC35N l=0.5u w=1.77u m=8
M8 N022 N026 0 0 TSMC35N l=0.5u w=1.33u m=16
M9 Vdd N004 N001 Vdd TSMC35P l=0.5u w=1u m=8
M10 Vdd N004 N007 Vdd TSMC35P l=0.5u w=1u m=8
V3 N026 0 1V
E4 N011 0 N001 0 0.5
E5 N012 N011 N007 0 0.5
E6 N004 0 N012 N018 10000
V4 N018 0 1.65V
M11 N001 N002 N023 0 TSMC35N l=0.5u w=1.77u m=8
M12 N007 N008 N023 0 TSMC35N l=0.5u w=1.77u m=8
M13 N023 N027 0 0 TSMC35N l=0.5u w=1.33u m=16
M14 Vdd N005 N001 Vdd TSMC35P l=0.5u w=1u m=8
M15 Vdd N005 N007 Vdd TSMC35P l=0.5u w=1u m=8
V6 N027 0 1V
E7 N014 0 N001 0 0.5
E8 N013 N014 N007 0 0.5
E9 N005 0 N013 N019 10000
V7 N019 0 1.65V
M16 N008 N001 N024 0 TSMC35N l=0.5u w=1.77u m=8
M17 N002 N007 N024 0 TSMC35N l=0.5u w=1.77u m=8
M18 N024 N028 0 0 TSMC35N l=0.5u w=1.33u m=16
M19 Vdd N006 N008 Vdd TSMC35P l=0.5u w=1u m=8
M20 Vdd N006 N002 Vdd TSMC35P l=0.5u w=1u m=8
V8 N028 0 1V
E10 N015 0 N008 0 0.5
E11 N016 N015 N002 0 0.5
E12 N006 0 N016 N020 10000
V9 N020 0 1.65V
M21 N029 N002 N038 0 TSMC35N l=0.5u w=1.77u m=8
M22 N037 N008 N038 0 TSMC35N l=0.5u w=1.77u m=8
M23 N038 N033 0 0 TSMC35N l=0.5u w=1.33u m=16
M24 Vdd N054 N029 Vdd TSMC35P l=0.5u w=1u m=8
M25 Vdd N054 N037 Vdd TSMC35P l=0.5u w=1u m=8
V10 N033 0 1V
E13 N050 0 N029 0 0.5
E14 N049 N050 N037 0 0.5
E15 N054 0 N049 N042 10000
V11 N042 0 1.65V
M26 N037 N037 N036 0 TSMC35N l=0.5u w=1.77u m=8
M27 N029 N029 N036 0 TSMC35N l=0.5u w=1.77u m=8
M28 N036 N032 0 0 TSMC35N l=0.5u w=1.33u m=16
M29 Vdd N053 N037 Vdd TSMC35P l=0.5u w=1u m=8
M30 Vdd N053 N029 Vdd TSMC35P l=0.5u w=1u m=8
V12 N032 0 1V
E16 N048 0 N037 0 0.5
E17 N047 N048 N029 0 0.5
E18 N053 0 N047 N041 10000
V13 N041 0 1.65V
M31 N037 V0- N035 0 TSMC35N l=0.5u w=1.77u m=8
M32 N029 V0+ N035 0 TSMC35N l=0.5u w=1.77u m=8
M33 N035 N031 0 0 TSMC35N l=0.5u w=1.33u m=16
M34 Vdd N052 N037 Vdd TSMC35P l=0.5u w=1u m=8
M35 Vdd N052 N029 Vdd TSMC35P l=0.5u w=1u m=8
V14 N031 0 1V
E19 N045 0 N037 0 0.5
E20 N046 N045 N029 0 0.5
E21 N052 0 N046 N040 10000
V15 N040 0 1.65V
M36 V0+ N037 N034 0 TSMC35N l=0.5u w=1.77u m=8
M37 V0- N029 N034 0 TSMC35N l=0.5u w=1.77u m=8
M38 N034 N030 0 0 TSMC35N l=0.5u w=1.33u m=16
M39 Vdd N051 V0+ Vdd TSMC35P l=0.5u w=1u m=8
M40 Vdd N051 V0- Vdd TSMC35P l=0.5u w=1u m=8
V16 N030 0 1V
E22 N044 0 V0+ 0 0.5
E23 N043 N044 V0- 0 0.5
E24 N051 0 N043 N039 10000
V17 N039 0 1.65V
C1 0 N001 0.945pF
C2 N007 0 0.945pF
C3 0 N002 3.229pF
C4 N008 0 3.229pF
C5 0 N029 2.284pF
C6 N037 0 2.284pF
C7 0 V0+ 1.337pF
C8 V0- 0 1.337pF
V18 Vin+ 0 1.65V AC 1
V19 0 Vin- -1.65V AC 1
.model NMOS NMOS
.model PMOS PMOS
.lib standard.mos
.include /home/akash/.wine/dosdevices/c:/users/akash/Desktop/ActiveFiltersPractice/tsmc035.lib
.ac dec 1000 0.1 1000Gig
.backanno
.end

* Results of the author's LTspice run, read from the files saved beside the schematic
* Operating Point, zero values left out:
*   V(n007) = 1.65 V
*   V(vin+) = 1.65 V
*   V(n021) = 555.5 mV
*   V(n001) = 1.65 V
*   V(vin-) = 1.65 V
*   V(n025) = 1 V
*   V(vdd) = 3.3 V
*   V(n003) = 1.784 V
*   V(n009) = 825.1 mV
*   V(n010) = 1.65 V
*   V(n017) = 1.65 V
*   V(n022) = 555.6 mV
*   V(n026) = 1 V
*   V(n004) = 1.784 V
*   V(n011) = 825.1 mV
*   V(n012) = 1.65 V
*   V(n018) = 1.65 V
*   V(n002) = 1.65 V
*   V(n023) = 555.6 mV
*   V(n008) = 1.65 V
*   V(n027) = 1 V
*   V(n005) = 1.784 V
*   V(n014) = 825.1 mV
*   V(n013) = 1.65 V
*   V(n019) = 1.65 V
*   V(n024) = 555.6 mV
*   V(n028) = 1 V
*   V(n006) = 1.784 V
*   V(n015) = 825.1 mV
*   V(n016) = 1.65 V
*   V(n020) = 1.65 V
*   V(n029) = 1.65 V
*   V(n038) = 555.6 mV
*   V(n037) = 1.65 V
*   V(n033) = 1 V
*   V(n054) = 1.784 V
*   V(n050) = 825.1 mV
*   V(n049) = 1.65 V
*   V(n042) = 1.65 V
*   V(n036) = 555.6 mV
*   V(n032) = 1 V
*   V(n053) = 1.784 V
*   V(n048) = 825.1 mV
*   V(n047) = 1.65 V
*   V(n041) = 1.65 V
*   V(v0-) = 1.65 V
*   V(n035) = 555.6 mV
*   V(v0+) = 1.65 V
*   V(n031) = 1 V
*   V(n052) = 1.784 V
*   V(n045) = 825.1 mV
*   V(n046) = 1.65 V
*   V(n040) = 1.65 V
*   V(n034) = 555.6 mV
*   V(n030) = 1 V
*   V(n051) = 1.784 V
*   V(n044) = 825.1 mV
*   V(n043) = 1.65 V
*   V(n039) = 1.65 V
*   Id(M40) = 130.1 µA
*   Ib(M40) = 13.28 pA
*   Is(M40) = -130.1 µA
*   Id(M39) = 130.1 µA
*   Ib(M39) = 13.28 pA
*   Is(M39) = -130.1 µA
*   Id(M35) = 130.1 µA
*   Ib(M35) = 13.28 pA
*   Is(M35) = -130.1 µA
*   Id(M34) = 130.1 µA
*   Ib(M34) = 13.28 pA
*   Is(M34) = -130.1 µA
*   Id(M30) = 130.1 µA
*   Ib(M30) = 13.28 pA
*   Is(M30) = -130.1 µA
*   Id(M29) = 130.1 µA
*   Ib(M29) = 13.28 pA
*   Is(M29) = -130.1 µA
*   Id(M25) = 130.1 µA
*   Ib(M25) = 13.28 pA
*   Is(M25) = -130.1 µA
*   Id(M24) = 130.1 µA
*   Ib(M24) = 13.28 pA
*   Is(M24) = -130.1 µA
*   Id(M20) = 130.1 µA
*   Ib(M20) = 13.28 pA
*   Is(M20) = -130.1 µA
*   Id(M19) = 130.1 µA
*   Ib(M19) = 13.28 pA
*   Is(M19) = -130.1 µA
*   Id(M15) = 130.1 µA
*   Ib(M15) = 13.28 pA
*   Is(M15) = -130.1 µA
*   Id(M14) = 130.1 µA
*   Ib(M14) = 13.28 pA
*   Is(M14) = -130.1 µA
*   Id(M10) = 130.1 µA
*   Ib(M10) = 13.28 pA
*   Is(M10) = -130.1 µA
*   Id(M9) = 130.1 µA
*   Ib(M9) = 13.28 pA
*   Is(M9) = -130.1 µA
*   Id(M5) = 130.1 µA
*   Ib(M5) = 13.28 pA
*   Is(M5) = -130.1 µA
*   Id(M4) = 130.1 µA
*   Ib(M4) = 13.28 pA
*   Is(M4) = -130.1 µA
*   Id(M38) = 260.3 µA
*   Ib(M38) = -9.05 pA
*   Is(M38) = -260.3 µA
*   Id(M37) = 130.1 µA
*   Ib(M37) = -17.81 pA
*   Is(M37) = -130.1 µA
*   Id(M36) = 130.1 µA
*   Ib(M36) = -17.81 pA
*   Is(M36) = -130.1 µA
*   Id(M33) = 260.3 µA
*   Ib(M33) = -9.05 pA
*   Is(M33) = -260.3 µA
*   Id(M32) = 130.1 µA
*   Ib(M32) = -17.81 pA
*   Is(M32) = -130.1 µA
*   Id(M31) = 130.1 µA
*   Ib(M31) = -17.81 pA
*   Is(M31) = -130.1 µA
*   Id(M28) = 260.3 µA
*   Ib(M28) = -9.05 pA
*   Is(M28) = -260.3 µA
*   Id(M27) = 130.1 µA
*   Ib(M27) = -17.81 pA
*   Is(M27) = -130.1 µA
*   Id(M26) = 130.1 µA
*   Ib(M26) = -17.81 pA
*   Is(M26) = -130.1 µA
*   Id(M23) = 260.3 µA
*   Ib(M23) = -9.05 pA
*   Is(M23) = -260.3 µA
*   Id(M22) = 130.1 µA
*   Ib(M22) = -17.81 pA
*   Is(M22) = -130.1 µA
*   Id(M21) = 130.1 µA
*   Ib(M21) = -17.81 pA
*   Is(M21) = -130.1 µA
*   Id(M18) = 260.3 µA
*   Ib(M18) = -9.05 pA
*   Is(M18) = -260.3 µA
*   Id(M17) = 130.1 µA
*   Ib(M17) = -17.81 pA
*   Is(M17) = -130.1 µA
*   Id(M16) = 130.1 µA
*   Ib(M16) = -17.81 pA
*   Is(M16) = -130.1 µA
*   Id(M13) = 260.3 µA
*   Ib(M13) = -9.05 pA
*   Is(M13) = -260.3 µA
*   Id(M12) = 130.1 µA
*   Ib(M12) = -17.81 pA
*   Is(M12) = -130.1 µA
*   Id(M11) = 130.1 µA
*   Ib(M11) = -17.81 pA
*   Is(M11) = -130.1 µA
*   Id(M8) = 260.3 µA
*   Ib(M8) = -9.05 pA
*   Is(M8) = -260.3 µA
*   Id(M7) = 130.1 µA
*   Ib(M7) = -17.81 pA
*   Is(M7) = -130.1 µA
*   Id(M6) = 130.1 µA
*   Ib(M6) = -17.81 pA
*   Is(M6) = -130.1 µA
*   Id(M3) = 260.2 µA
*   Ib(M3) = -9.048 pA
*   Is(M3) = -260.2 µA
*   Id(M2) = 130.1 µA
*   Ib(M2) = -17.81 pA
*   Is(M2) = -130.1 µA
*   Id(M1) = 130.1 µA
*   Ib(M1) = -17.81 pA
*   Is(M1) = -130.1 µA
*   I(V5) = -2.082 mA